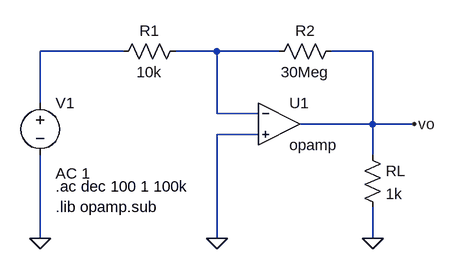
[diagram p0: schematic Ej_1_a.asc]
Ej_1_a.asc, the LTspice schematic file:
Version 4
SHEET 1 880 680
WIRE -128 64 -256 64
WIRE 16 64 -48 64
WIRE 112 64 16 64
WIRE 256 64 192 64
WIRE -256 144 -256 64
WIRE 16 160 16 64
WIRE 80 160 16 160
WIRE 256 176 256 64
WIRE 256 176 144 176
WIRE 320 176 256 176
WIRE 80 192 16 192
WIRE 256 224 256 176
WIRE -256 352 -256 224
WIRE 16 352 16 192
WIRE 256 352 256 304
FLAG 16 352 0
FLAG -256 352 0
FLAG 320 176 vo
FLAG 256 352 0
SYMBOL res -32 48 R90
WINDOW 0 0 56 VBottom 2
WINDOW 3 32 56 VTop 2
SYMATTR InstName R1
SYMATTR Value 10k
SYMBOL res 208 48 R90
WINDOW 0 0 56 VBottom 2
WINDOW 3 32 56 VTop 2
SYMATTR InstName R2
SYMATTR Value 30Meg
SYMBOL voltage -256 128 R0
WINDOW 3 24 152 Left 2
WINDOW 123 24 124 Left 2
WINDOW 39 0 0 Left 0
SYMATTR Value ""
SYMATTR Value2 AC 1
SYMATTR InstName V1
SYMBOL OpAmps\\opamp 112 112 R0
SYMATTR InstName U1
SYMBOL res 240 208 R0
SYMATTR InstName RL
SYMATTR Value 1k
TEXT -232 272 Left 2 !.ac dec 100 1 100k
TEXT -232 304 Left 2 !.lib opamp.sub

The netlist it stands for:
* Ej_1_a.asc
R1 N002 N001 10k
R2 vo N002 30Meg
V1 N001 0 AC 1
XU1 N002 0 vo opamp Aol=100K GBW=10Meg  ; pins invin noninvin out
RL vo 0 1k
.ac dec 100 1 100k
.lib opamp.sub
.backanno
.end